# Altium schematic sheet Output_Terminals.SchDoc: Output Terminals & Voltage detection
size A3; DocumentNumber: 9; SheetNumber: 9; SheetTotal: 20
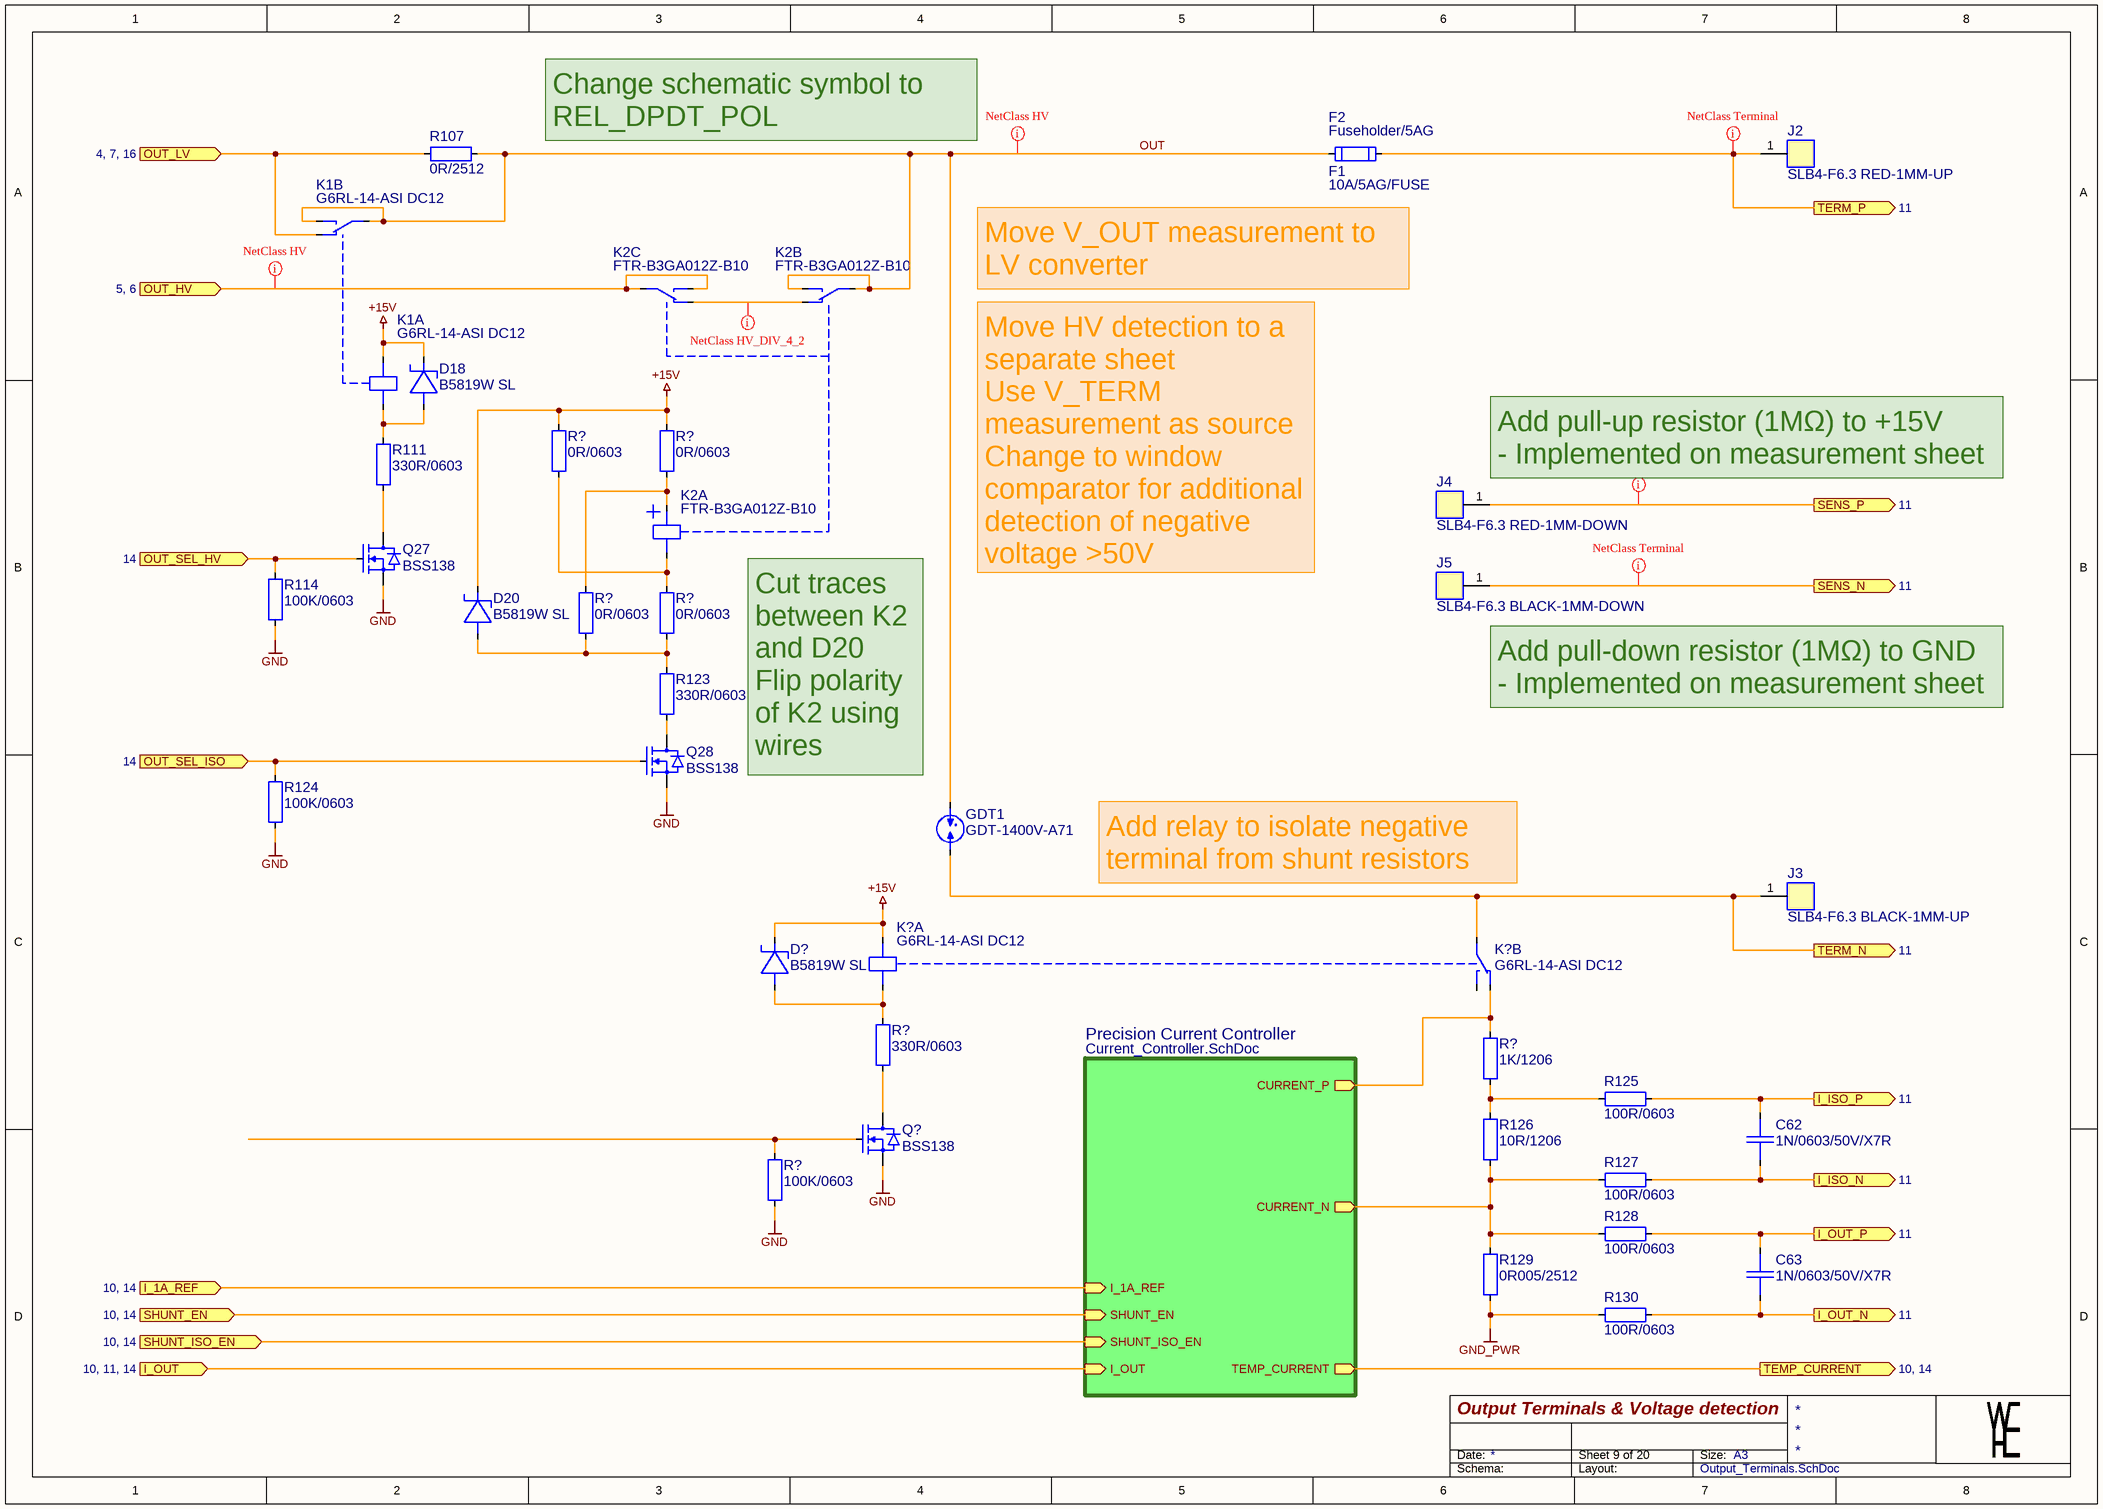
[diagram p0: Output_Terminals.SchDoc]

## Parts
(Parts that share a designator on the sheet are numbered #1, #2 ... from top to bottom, then left to right.)
C62  1N/0603/50V/X7R  [CAP0603_X7R]
C63  1N/0603/50V/X7R  [CAP0603_X7R]
D18  B5819W SL  [SOD3718X125]
D20  B5819W SL  [SOD3718X125]
D?  B5819W SL  [SOD3718X125]
F1  10A/5AG/FUSE  [Fuse_5AG_5mm]
F2  Fuseholder/5AG  [KEYSTONE_3576]
GDT1  GDT-1400V-A71  [GDTAD1200W100L800D800H1200]
J2  SLB4-F6.3 RED-1MM-UP  [SLB4-F6.3-RED]
J3  SLB4-F6.3 BLACK-1MM-UP  [SLB4-F6.3-BLACK]
J4  SLB4-F6.3 RED-1MM-DOWN  [SLB4-F6.3-RED]
J5  SLB4-F6.3 BLACK-1MM-DOWN  [SLB4-F6.3-BLACK]
K1  G6RL-14-ASI DC12  [G6RL-1]  (parts A,B of 2)
K2  FTR-B3GA012Z-B10  [FTR-B3G]  (parts A,B,C of 3)
K?#1  G6RL-14-ASI DC12  [G6RL-1]  (part A of 2)
K?#2  G6RL-14-ASI DC12  [G6RL-1]  (part B of 2)
Q27  BSS138  [SOT2395P280X125-3-SE]
Q28  BSS138  [SOT2395P280X125-3-SE]
Q?  BSS138  [SOT2395P280X125-3-SE]
R107  0R/2512  [R2512-0.65-WW]
R111  330R/0603  [R0603-0.40-WW]
R114  100K/0603  [R0603-0.40-WW]
R123  330R/0603  [R0603-0.40-WW]
R124  100K/0603  [R0603-0.40-WW]
R125  100R/0603  [R0603-0.40-WW]
R126  10R/1206  [R1206-0.80-WW]
R127  100R/0603  [R0603-0.40-WW]
R128  100R/0603  [R0603-0.40-WW]
R129  0R005/2512  [R2512-0.65-WW]
R130  100R/0603  [R0603-0.40-WW]
R?#1  0R/0603  [R0603-0.40-WW]
R?#2  0R/0603  [R0603-0.40-WW]
R?#3  0R/0603  [R0603-0.40-WW]
R?#4  0R/0603  [R0603-0.40-WW]
R?#5  330R/0603  [R0603-0.40-WW]
R?#6  1K/1206  [R1206-0.80-WW]
R?#7  100K/0603  [R0603-0.40-WW]

## Sub-sheets
Precision Current Controller = Current_Controller.SchDoc: TEMP_CURRENT (out), CURRENT_P (out), I_OUT (in), SHUNT_ISO_EN (in), SHUNT_EN (in), I_1A_REF (in), CURRENT_N (out)

## Ports
I_1A_REF (in, see 10, 14), I_ISO_N (out, see 11), I_ISO_P (out, see 11), I_OUT (in, see 10, 11, 14), I_OUT_N (out, see 11), I_OUT_P (out, see 11), OUT_HV (in, see 5, 6), OUT_LV (in, see 4, 7, 16), OUT_SEL_HV (in, see 14), OUT_SEL_ISO (in, see 14), SENS_N (out, see 11), SENS_P (out, see 11), SHUNT_EN (in, see 10, 14), SHUNT_ISO_EN (in, see 10, 14), TEMP_CURRENT (out, see 10, 14), TERM_N (out, see 11), TERM_P (out, see 11)

## Nets
+15V: D18.1(C) D20.1(C) D?.1(C) K1.2 K?#1.1 R?#1.1 R?#2.1
GND: Q27.2(SOURCE) Q28.2(SOURCE) Q?.2(SOURCE) R114.2 R124.2 R?#7.2
GND_PWR: R129.2 R130.1
I_1A_REF: port I_1A_REF, sheet Precision Current Controller/I_1A_REF
I_ISO_N: C62.2 R127.2 ; port I_ISO_N
I_ISO_P: C62.1 R125.2 ; port I_ISO_P
I_OUT: port I_OUT, sheet Precision Current Controller/I_OUT
I_OUT_N: C63.2 R130.2 ; port I_OUT_N
I_OUT_P: C63.1 R128.2 ; port I_OUT_P
OUT: F2.1 GDT1.1 K1.3(COM1) K1.5(NO1) K2.3(COM1) K2.5(NO1) R107.1
OUT_HV: K2.6(COM2) K2.8(NO2) ; port OUT_HV
OUT_LV: K1.4(NC1) R107.2 ; port OUT_LV
OUT_SEL_HV: Q27.1(GATE) R114.1 ; port OUT_SEL_HV
OUT_SEL_ISO: Q28.1(GATE) R124.1 ; port OUT_SEL_ISO
SENS_N: J5.1 ; port SENS_N
SENS_P: J4.1 ; port SENS_P
SHUNT_EN: port SHUNT_EN, sheet Precision Current Controller/SHUNT_EN
SHUNT_ISO_EN: port SHUNT_ISO_EN, sheet Precision Current Controller/SHUNT_ISO_EN
TEMP_CURRENT: port TEMP_CURRENT, sheet Precision Current Controller/TEMP_CURRENT
TERM_N: GDT1.2 J3.1 K?#2.3(COM1) ; port TERM_N
TERM_P: F2.2 J2.1 ; port TERM_P
NetD18_2: D18.2(A) K1.1 R111.1
NetD20_2: D20.2(A) R123.1 R?#3.2 R?#4.2
NetD?_2: D?.2(A) K?#1.2 R?#5.1
NetK2_1: K2.1 R?#2.2 R?#3.1
NetK2_2: K2.2 R?#1.2 R?#4.1
NetK2_4: K2.4(NC1) K2.7(NC2)
NetK?#2_4: K?#2.4(NC1) R?#6.1 ; sheet Precision Current Controller/CURRENT_P
NetQ27_3: Q27.3(DRAIN) R111.2
NetQ28_3: Q28.3(DRAIN) R123.2
NetQ?_1: Q?.1(GATE) R?#7.1
NetQ?_3: Q?.3(DRAIN) R?#5.2
NetR125_1: R125.1 R126.1 R?#6.2
NetR126_2: R126.2 R127.1 R128.1 R129.1 ; sheet Precision Current Controller/CURRENT_N

Not connected (* = marked no-connect by the designer): K?#2 5(NO1)

## Layout directives
net class HV: OUT, OUT_HV
net class Terminal: SENS_N, SENS_P, TERM_P
net class HV_DIV_4_2: NetK2_4

## Notes on the sheet
- Change schematic symbol to REL_DPDT_POL
- Move V_OUT measurement to LV converter
- (near J4) Add pull-up resistor (1MΩ) to +15V
  - Implemented on measurement sheet
- Move HV detection to a separate sheet
  Use V_TERM measurement as source
  Change to window comparator for additional detection of negative voltage >50V
- (near J5) Add pull-down resistor (1MΩ) to GND
  - Implemented on measurement sheet
- (near GDT1) Cut traces between K2 and D20
  Flip polarity of K2 using wires
- (near GDT1) Alternate relay options:
  - IM06CGR
  (fits on same footprint)
  (reversed coil polarity)
  - IM06JR
  (requires different footprint)
  (coil polarity unverified)
- Add relay to isolate negative terminal from shunt resistors
- Date:
- Size:
- A3
- Schema:
- Layout:

## Library data of the parts
C62 C63 = 1N/0603/50V/X7R: CAP SM 0603 1.0nF 50V X7R; Manufacturer: GENERIC; Manufacturer 1: YAGEO; Manufacturer Part Number 1: CC0603KPX7R9BB102; Absolute Value: 1E-9; Eurocircuits GPN: GPC0603102; Part Number: 1N/0603/50V/X7R; Package: 0603; Value: 1.0nF; HelpURL: https://www.yageo.com/upload/media/product/app/datasheet/mlcc/upy-gphc_x7r_6_3v-to-250v.pdf; Supplier 1: Digi-Key; Supplier Part Number 1: 13-CC0603KPX7R9BB102CT-ND; Manufacturer 2: YAGEO; Manufacturer Part Number 2: CC0603KRX7R9BB102; Supplier 2: Digi-Key; Supplier Part Number 2: 311-1080-1-ND; JLC Type: Basic; Manufacturer Part Number 3: CL10B102KB8NNNC; Supplier 3: LCSC; Supplier Part Number 3: C1588
D18 D20 D? = B5819W SL: 40V 600mV@1A 1A SOD-123 Schottky Barrier Diodes; Manufacturer: GENERIC; Manufacturer 1: SMC Diode Solutions; Part Number: B5819W SL; Package: SOD-123; Value: B5819W SL; Absolute Value: 40V; HelpURL: https://datasheet.lcsc.com/lcsc/2304140030_Jiangsu-Changjing-Electronics-Technology-Co---Ltd--B5819W-SL_C8598.pdf; Manufacturer Part Number 1: B5819WSL; Supplier 1: Digikey; Supplier Part Number 1: 1655-B5819WSLCT-ND; Manufacturer 3: Jiangsu Changjing Electronics Technology Co., Ltd.; Manufacturer Part Number 3: B5819W SL; Supplier 3: LCSC; Supplier Part Number 3: C8598; JLC Type: Basic
F1 = 10A/5AG/FUSE: Fuse 1000V AC/DC 10A 5AG 10.3x38mm; Manufacturer: Phoenix Contact; Manufacturer Part Number 1: 3061334; Part Number: 10A/5AG/FUSE; Package: 5AG; Value: 10A; HelpURL: https://www.phoenixcontact.com/us/products/3061334/pdf; Manufacturer 1: Phoenix Contact; Supplier 1: Digi-Key; Supplier Part Number 1: 277-15212-ND
F2 = Fuseholder/5AG: Manufacturer 1: Keystone Electronics; Manufacturer Part Number 1: 3576; Part Number: Fuseholder/5AG; Supplier 1: Digi-Key; Supplier Part Number 1: 36-3576-ND; HelpURL: https://www.keyelco.com/product-pdf.cfm?p=347; Package: 5AG; Manufacturer 2: Keystone Electronics; Manufacturer Part Number 2: 3576; Supplier 2: Mouser; Supplier Part Number 2: 534-3576
GDT1 = GDT-1400V-A71-12MM-4MM: 2-electrode surge arrester, 1400V, 10kA, A71 series, 12mm lead spacing, 4mm standoff height; Manufacturer: TDK; Manufacturer 1: EPCOS - TDK Electronics; Manufacturer Part Number 1: B88069X2180S102; Absolute Value: 1400; Part Number: GDT-1400V-A71-12MM-4MM; Package: Axial; Value: 1400V; HelpURL: https://www.tdk-electronics.tdk.com/inf/100/ds/A71-H14X-X2180S102.pdf; Supplier 1: Digi-Key; Supplier Part Number 1: 495-4270-ND; Manufacturer 2: EPCOS - TDK Electronics; Manufacturer Part Number 2: B88069X3500T502; Supplier 2: Digi-Key; Supplier Part Number 2: 495-5911-1-ND
J2 = SLB4-F6.3 RED-1MM-UP: SLB4-F6.3 Insulated, rigid, Ø 4 mm, accepting spring-loaded Ø 4 mm plugs with rigid insulating sleeve. Machined brass. Insulation material UL94 V-0. The socket is screwed into pre-drilled panels of plastic, metal, etc. Flat connecting tab 6.3 mm x 0.8 mm.; Manufacturer: Stäubli; Manufacturer 1: Stäubli Electrical Connectors; Manufacturer Part Number 1: 23.3060-22; System: Connector; Part Number: SLB4-F6.3 RED-1MM-UP; HelpURL: https://www.staubli.com/content/dam/ecs/technical-documentation/datasheets/TM/23.3060_en.pdf; Supplier 1: Distrelec; Supplier Part Number 1: 30136218
J3 = SLB4-F6.3 BLACK-1MM-UP: SLB4-F6.3 Insulated, rigid, Ø 4 mm, accepting spring-loaded Ø 4 mm plugs with rigid insulating sleeve. Machined brass. Insulation material UL94 V-0. The socket is screwed into pre-drilled panels of plastic, metal, etc. Flat connecting tab 6.3 mm x 0.8 mm.; Manufacturer: Stäubli; Manufacturer 1: Stäubli Electrical Connectors; Manufacturer Part Number 1: 23.3060-21; System: Connector; Part Number: SLB4-F6.3 BLACK-1MM-UP; HelpURL: https://www.staubli.com/content/dam/ecs/technical-documentation/datasheets/TM/23.3060_en.pdf; Supplier 1: Distrelec; Supplier Part Number 1: 30136217
J4 = SLB4-F6.3 RED-1MM-DOWN: SLB4-F6.3 Insulated, rigid, Ø 4 mm, accepting spring-loaded Ø 4 mm plugs with rigid insulating sleeve. Machined brass. Insulation material UL94 V-0. The socket is screwed into pre-drilled panels of plastic, metal, etc. Flat connecting tab 6.3 mm x 0.8 mm.; Manufacturer: Stäubli; Manufacturer 1: Stäubli Electrical Connectors; Manufacturer Part Number 1: 23.3060-22; System: Connector; Part Number: SLB4-F6.3 RED-1MM-DOWN; HelpURL: https://www.staubli.com/content/dam/ecs/technical-documentation/datasheets/TM/23.3060_en.pdf; Supplier 1: Distrelec; Supplier Part Number 1: 30136218
J5 = SLB4-F6.3 BLACK-1MM-DOWN: SLB4-F6.3 Insulated, rigid, Ø 4 mm, accepting spring-loaded Ø 4 mm plugs with rigid insulating sleeve. Machined brass. Insulation material UL94 V-0. The socket is screwed into pre-drilled panels of plastic, metal, etc. Flat connecting tab 6.3 mm x 0.8 mm.; Manufacturer: Stäubli; Manufacturer 1: Stäubli Electrical Connectors; Manufacturer Part Number 1: 23.3060-21; System: Connector; Part Number: SLB4-F6.3 BLACK-1MM-DOWN; HelpURL: https://www.staubli.com/content/dam/ecs/technical-documentation/datasheets/TM/23.3060_en.pdf; Supplier 1: Distrelec; Supplier Part Number 1: 30136217
K1 K?#1 K?#2 = G6RL-14-ASI DC12: RELAY GEN PURPOSE SPDT 8A 12V; Manufacturer: Omron Electronics Inc-EMC Div; Part Number: G6RL-14-ASI DC12; HelpURL: https://omronfs.omron.com/en_US/ecb/products/pdf/en-g6rl.pdf; Manufacturer 1: Omron Electronics Inc-EMC Div; Manufacturer Part Number 1: G6RL-14-ASI DC12; Supplier 1: Digi-Key; Supplier Part Number 1: 39-G6RL-14-ASIDC12-ND
K2 = FTR-B3GA012Z-B10: FTR-B3 Series Ultra Miniature Relay 2 Poles - 2 A (Low Profile Signal Relay); Manufacturer: Fujitsu; Part Number: FTR-B3GA012Z-B10; HelpURL: https://www.fujitsu.com/sg/imagesgig5/ftr-b3.pdf; Manufacturer 3: FUJITSU; Manufacturer Part Number 3: FTR-B3GA012Z-B10; Supplier 3: LCSC; Supplier Part Number 3: C2992429; JLC Type: Extended
Q27 Q28 Q? = BSS138: N-Kanal 50 V 220mA (Ta) 350mW (Ta) Oberflächenmontage SOT-23; Manufacturer: GENERIC; Manufacturer 1: ANBON SEMICONDUCTOR (INT'L) LIMITED; Part Number: BSS138; Package: SOT23; HelpURL: https://mm.digikey.com/Volume0/opasdata/d220001/medias/docus/3037/BSS138.pdf; Manufacturer Part Number 1: BSS138; Supplier 1: Digi-Key; Supplier Part Number 1: 4530-BSS138CT-ND; Manufacturer 3: FOSAN; Manufacturer Part Number 3: BSS138; Supplier 3: LCSC; Supplier Part Number 3: C2926186; JLC Type: Extended; Manufacturer 2: FOSAN; Manufacturer Part Number 2: BSS138; Supplier 2: LCSC; Supplier Part Number 2: C2926186
R107 = 0R/2512: RES SM 2512 0R; Manufacturer: GENERIC; Absolute Value: 0; Part Number: 0R/2512; Package: 2512; Value: 0R
R111 R123 R?#5 = 330R/0603: RES SM 0603 330R; Manufacturer: GENERIC; Manufacturer 1: YAGEO; Manufacturer Part Number 1: RC0603FR-13330RL; Absolute Value: 330; Eurocircuits GPN: GPR0603330R; Part Number: 330R/0603; Package: 0603; Value: 330R; HelpURL: https://www.yageogroup.com/content/datasheet/asset/file/PYU-RC_GROUP_51_ROHS_L; Supplier 1: Digi-Key; Supplier Part Number 1: 13-RC0603FR-13330RLCT-ND; Manufacturer 2: YAGEO; Manufacturer Part Number 2: RC0603FR-10330RL; Supplier 2: Digi-Key; Supplier Part Number 2: 13-RC0603FR-10330RLCT-ND; Manufacturer 3: UNI-ROYAL(Uniroyal Elec); Manufacturer Part Number 3: 0603WAF3300T5E; Supplier 3: LCSC; Supplier Part Number 3: C23138; JLC Type: Basic
R114 R124 R?#7 = 100K/0603: RES SM 0603 100K; Manufacturer: GENERIC; Manufacturer 1: YAGEO; Manufacturer Part Number 1: RC0603FR-13100KL; Absolute Value: 100000; Eurocircuits GPN: GPR0603100K; Part Number: 100K/0603; Package: 0603; Value: 100K; HelpURL: https://www.yageogroup.com/content/datasheet/asset/file/PYU-RC_GROUP_51_ROHS_L; Supplier 1: Digi-Key; Supplier Part Number 1: 13-RC0603FR-13100KLCT-ND; Manufacturer 2: YAGEO; Manufacturer Part Number 2: RC0603FR-10100KL; Supplier 2: Digi-Key; Supplier Part Number 2: 13-RC0603FR-10100KLCT-ND; Manufacturer 3: UNI-ROYAL(Uniroyal Elec); Manufacturer Part Number 3: 0603WAF1003T5E; Supplier 3: LCSC; Supplier Part Number 3: C25803; JLC Type: Basic
R125 R127 R128 R130 = 100R/0603: RES SM 0603 100R; Manufacturer: GENERIC; Manufacturer 1: YAGEO; Manufacturer Part Number 1: RC0603FR-13100RL; Absolute Value: 100; Eurocircuits GPN: GPR0603100R; Part Number: 100R/0603; Package: 0603; Value: 100R; HelpURL: https://www.yageogroup.com/content/datasheet/asset/file/PYU-RC_GROUP_51_ROHS_L; Supplier 1: Digi-Key; Supplier Part Number 1: 13-RC0603FR-13100RLCT-ND; Manufacturer 2: YAGEO; Manufacturer Part Number 2: RC0603FR-10100RL; Supplier 2: Digi-Key; Supplier Part Number 2: 13-RC0603FR-10100RLCT-ND; Manufacturer 3: UNI-ROYAL(Uniroyal Elec); Manufacturer Part Number 3: 0603WAF1000T5E; Supplier 3: LCSC; Supplier Part Number 3: C22775
R126 = 10R/1206: RES SM 1206 10R; Manufacturer: GENERIC; Absolute Value: 10; Part Number: 10R/1206; Package: 1206; Value: 10R
R129 = 0R005/2512: RES SM 2512 0R005; Manufacturer: GENERIC; Manufacturer 1: Ohmite; Manufacturer Part Number 1: MCS3264R005FER; Absolute Value: 0.005; Part Number: 0R005/2512; Package: 2512; Value: 0R005; HelpURL: https://www.ohmite.com/assets/docs/res_mcs.pdf?r=false; Supplier 1: Digi-Key; Supplier Part Number 1: MCS3264R005FERCT-ND; Manufacturer 3: prosemi; Manufacturer Part Number 3: LMP25MF2P0R005; Supplier 3: LCSC; Supplier Part Number 3: C2937402
R?#1-R?#4 = 0R/0603: RES SM 0603 0R; Manufacturer: GENERIC; Manufacturer 1: YAGEO; Manufacturer Part Number 1: RC0603FR-070RL; Absolute Value: 0; Eurocircuits GPN: GPR06030R; Part Number: 0R/0603; Package: 0603; Value: 0R; HelpURL: https://www.yageogroup.com/content/datasheet/asset/file/PYU-RC_GROUP_51_ROHS_L; Supplier 1: Digi-Key; Supplier Part Number 1: 311-0.0HRCT-ND; Manufacturer 2: YAGEO; Manufacturer Part Number 2: RC0603FR-130RL; Supplier 2: Digi-Key; Supplier Part Number 2: 13-RC0603FR-130RLCT-ND; Manufacturer 3: UNI-ROYAL(Uniroyal Elec); Manufacturer Part Number 3: 0603WAF0000T5E; Supplier 3: LCSC; Supplier Part Number 3: C21189; JLC Type: Basic
R?#6 = 1K/1206: RES SM 1206 1K; Manufacturer: GENERIC; Absolute Value: 1000; Part Number: 1K/1206; Package: 1206; Value: 1K